# Altium schematic sheet L506_M_V1.1.SchDoc
size A3
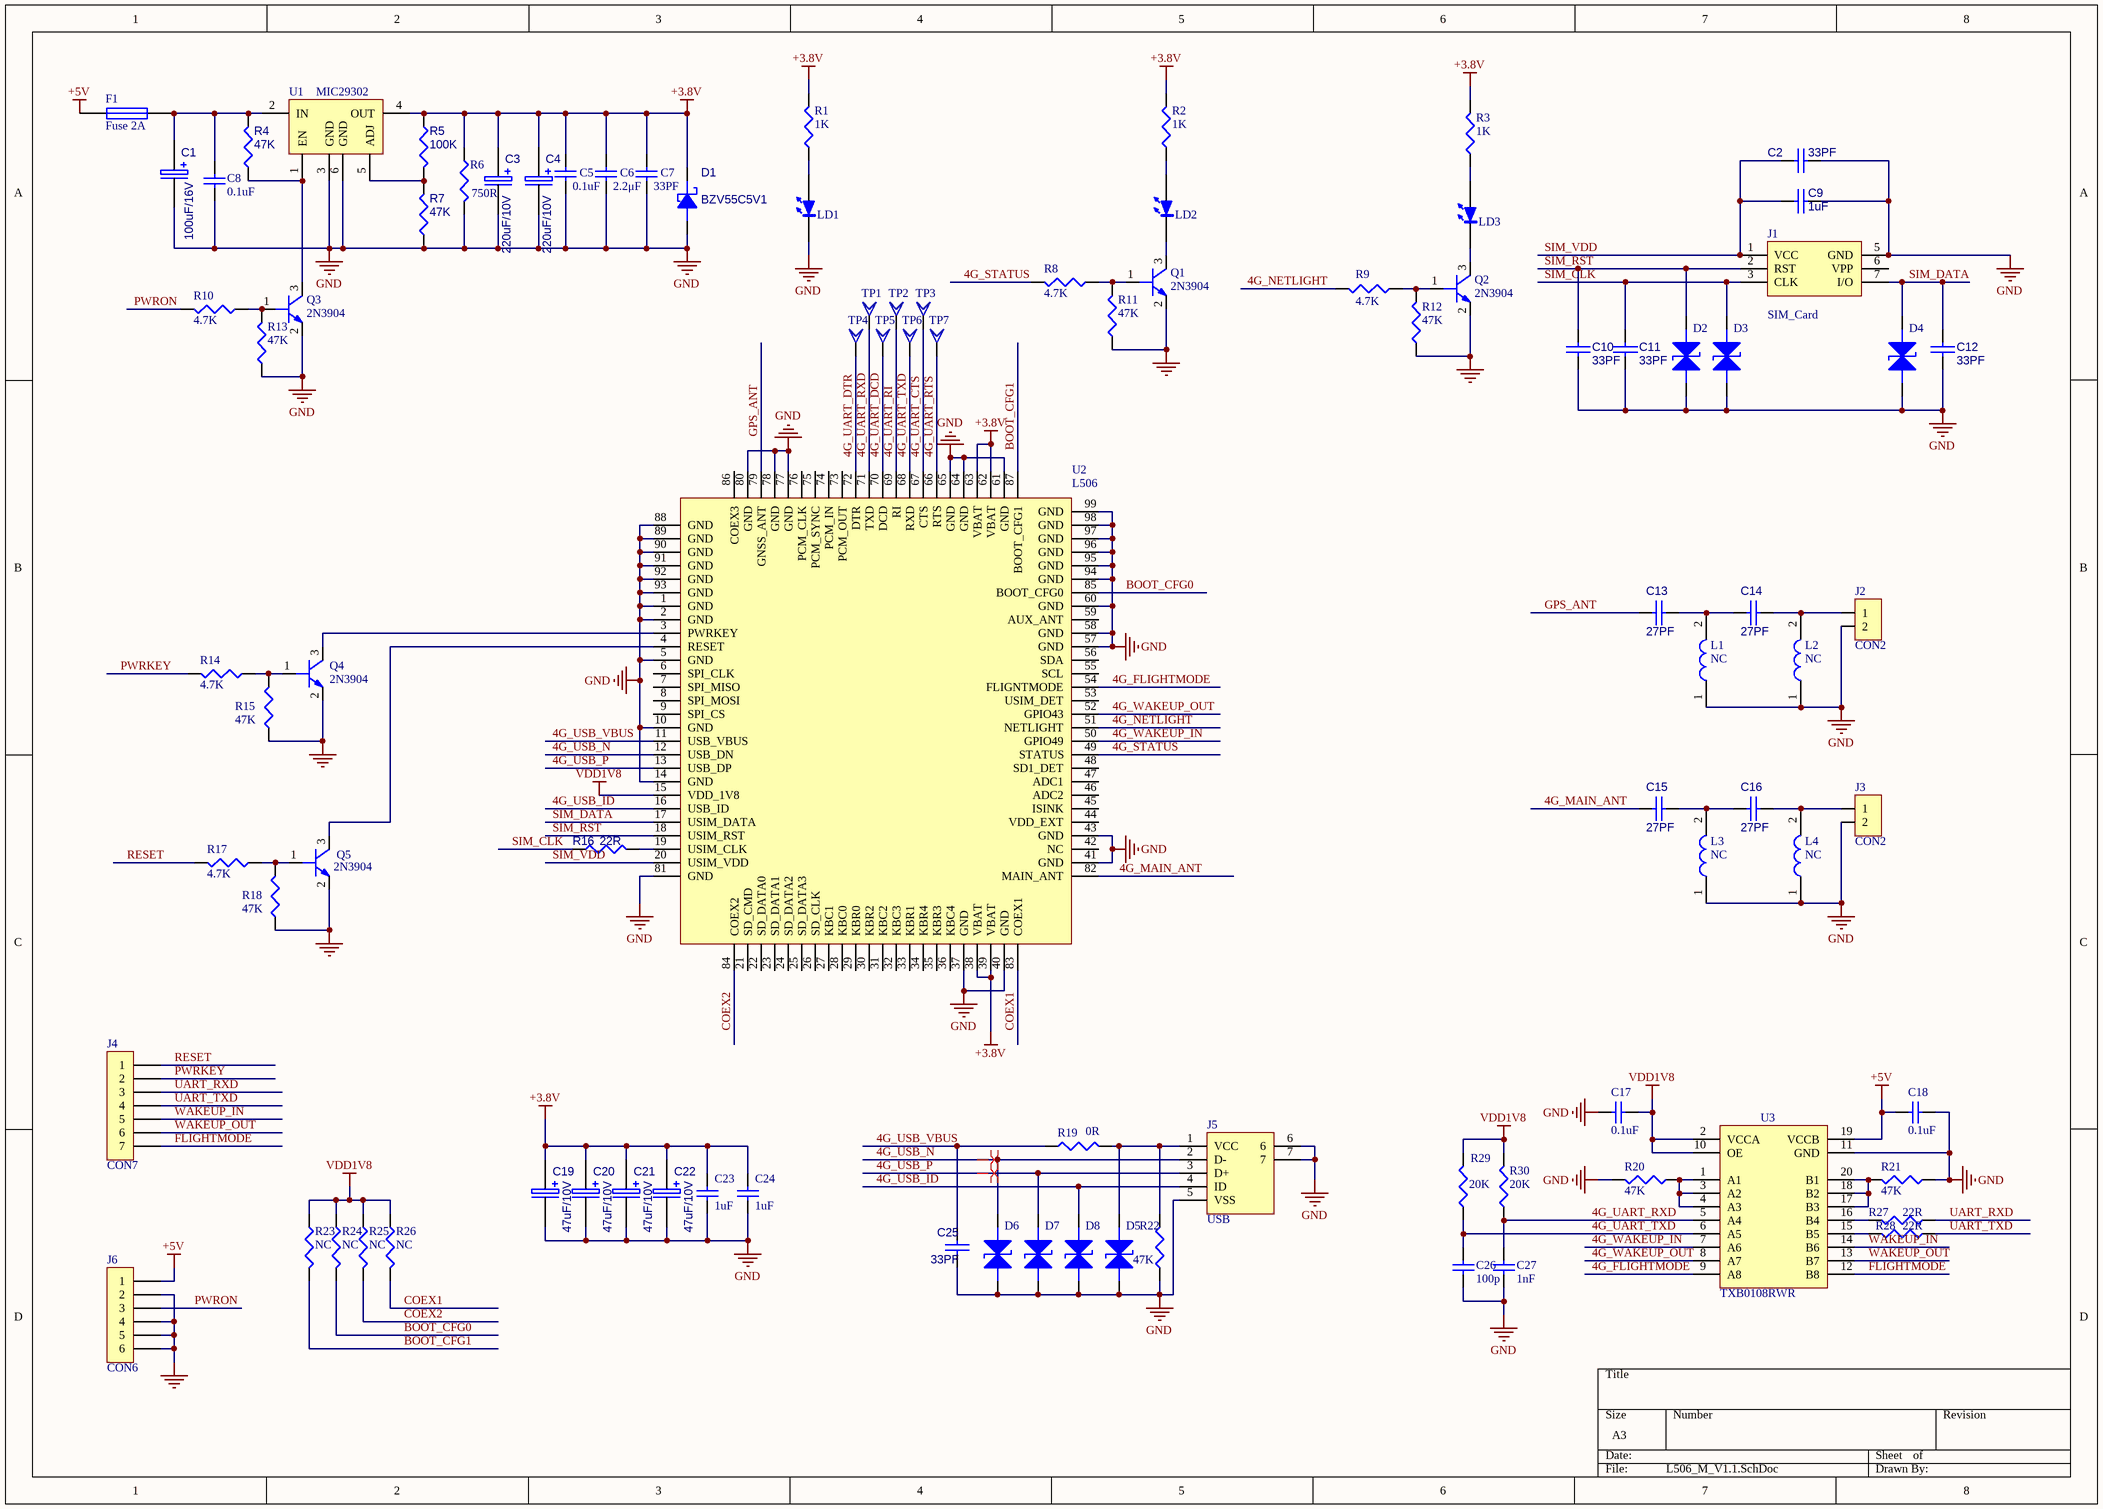
[diagram p0: L506_M_V1.1.SchDoc]

## Parts
C1  100uF/16V  [C_TAN_C]
C2  33PF  [0603_C]
C3  220uF/10V  [C_TAN_D]
C4  220uF/10V  [C_TAN_D]
C5  0.1uF  [0603_C]
C6  2.2μF  [0603_C]
C7  33PF  [0603_C]
C8  0.1uF  [0603_C]
C9  1uF  [0603_C]
C10  33PF  [0603_C]
C11  33PF  [0603_C]
C12  33PF  [0603_C]
C13  27PF  [0603_C]
C14  27PF  [0603_C]
C15  27PF  [0603_C]
C16  27PF  [0603_C]
C17  0.1uF  [0603_C]
C18  0.1uF  [0603_C]
C19  47uF/10V  [C_TAN_B]
C20  47uF/10V  [C_TAN_B]
C21  47uF/10V  [C_TAN_B]
C22  47uF/10V  [C_TAN_B]
C23  1uF  [0603_C]
C24  1uF  [0603_C]
C25  33PF  [0603_C]
C26  100p  [0603_C]
C27  1nF  [0603_C]
D1  BZV55C5V1  [SOD-80]
D2  EGA10603V05A1-B  [0603_R]  (value not drawn)
D3  EGA10603V05A1-B  [0603_R]  (value not drawn)
D4  EGA10603V05A1-B  [0603_R]  (value not drawn)
D5  EGA10603V05A1-B  [0603_R]  (value not drawn)
D6  EGA10603V05A1-B  [0603_R]  (value not drawn)
D7  EGA10603V05A1-B  [0603_R]  (value not drawn)
D8  EGA10603V05A1-B  [0603_R]  (value not drawn)
F1  Fuse 2A  [1812_F]
J1  SIM_Card  [MicroSIM-6]
J2  CON2  [RF-Z]
J3  CON2  [RF-Z]
J4  CON7  [SIP7]
J5  USB
J6  CON6  [SIP6]
L1  NC  [0603_R]
L2  NC  [0603_R]
L3  NC  [0603_R]
L4  NC  [0603_R]
LD1  WHITE  [LED_0603]  (value not drawn)
LD2  WHITE  [LED_0603]  (value not drawn)
LD3  WHITE  [LED_0603]  (value not drawn)
Q1  2N3904  [SOT23]
Q2  2N3904  [SOT23]
Q3  2N3904  [SOT23]
Q4  2N3904  [SOT23]
Q5  2N3904  [SOT23]
R1  1K  [0603_R]
R2  1K  [0603_R]
R3  1K  [0603_R]
R4  47K  [0603_R]
R5  100K  [0603_R]
R6  750R  [0603_R]
R7  47K  [0603_R]
R8  4.7K  [0603_R]
R9  4.7K  [0603_R]
R10  4.7K  [0603_R]
R11  47K  [0603_R]
R12  47K  [0603_R]
R13  47K  [0603_R]
R14  4.7K  [0603_R]
R15  47K  [0603_R]
R16  22R  [0603_R]
R17  4.7K  [0603_R]
R18  47K  [0603_R]
R19  0R  [0603_R]
R20  47K  [0603_R]
R21  47K  [0603_R]
R22  47K  [0603_R]
R23  NC  [0603_R]
R24  NC  [0603_R]
R25  NC  [0603_R]
R26  NC  [0603_R]
R27  22R  [0603_R]
R28  22R  [0603_R]
R29  20K  [0603_R]
R30  20K  [0603_R]
TP1  Component_1  [TP-40]  (value not drawn)
TP2  Component_1  [TP-40]  (value not drawn)
TP3  Component_1  [TP-40]  (value not drawn)
TP4  Component_1  [TP-40]  (value not drawn)
TP5  Component_1  [TP-40]  (value not drawn)
TP6  Component_1  [TP-40]  (value not drawn)
TP7  Component_1  [TP-40]  (value not drawn)
U1  MIC29302  [TO-263-5]
U2  L506  [L506]
U3  TXB0108RWR  [TSSP20]

## Nets
+3.8V: C3.1(+) C4.1(+) C5.2 C6.2 C7.2 C19.1(+) C20.1(+) C21.1(+) C22.1(+) C23.2 C24.2 D1.2(CATHODE) R1.1 R2.1 R3.1 R5.2 R6.2 U1.4(OUT) U2.38(VBAT) U2.39(VBAT) U2.62(VBAT) U2.63(VBAT)
+5V: C18.2 F1.1 J6.1 U3.19(VCCB)
GND: C1.2(-) C2.2 C3.2(-) C4.2(-) C5.1 C6.1 C7.1 C8.1 C9.2 C10.1 C11.1 C12.1 C17.1 C18.1 C19.2(-) C20.2(-) C21.2(-) C22.2(-) C23.1 C24.1 C25.1 C26.1 C27.1 D1.1(ANODE) D2.1 D3.1 D4.1 D5.1 D6.1 D7.1 D8.1 J1.5(GND) J2.2 J3.2 J5.5(VSS) J5.6 J5.7 J6.2 J6.4 J6.5 J6.6 L1.1 L2.1 L3.1 L4.1 LD1.K Q1.2(EMITTER) Q2.2(EMITTER) Q3.2(EMITTER) Q4.2(EMITTER) Q5.2(EMITTER) R6.1 R7.2 R11.2 R12.2 R13.2 R15.2 R18.2 R20.2 R21.1 R22.2 U1.3(GND) U1.6(GND) U2.1(GND) U2.2(GND) U2.5(GND) U2.10(GND) U2.14(GND) U2.37(GND) U2.40(GND) U2.41(GND) U2.43(GND) U2.57(GND) U2.58(GND) U2.60(GND) U2.61(GND) U2.64(GND) U2.65(GND) U2.77(GND) U2.78(GND) U2.80(GND) U2.81(GND) U2.88(GND) U2.89(GND) U2.90(GND) U2.91(GND) U2.92(GND) U2.93(GND) U2.94(GND) U2.95(GND) U2.96(GND) U2.97(GND) U2.98(GND) U2.99(GND) U3.11(GND)
VDD1V8: C17.2 R23.1 R24.1 R25.1 R26.1 R29.2 R30.2 U2.15(VDD_1V8) U3.2(VCCA) U3.10(OE)
4G_FLIGHTMODE: U2.54(FLIGNTMODE) U3.9(A8)
4G_MAIN_ANT: C15.1 U2.82(MAIN_ANT)
4G_NETLIGHT: R9.1 U2.51(NETLIGHT)
4G_STATUS: R8.1 U2.49(STATUS)
4G_UART_CTS: TP3.1 U2.67(CTS)
4G_UART_DCD: TP5.1 U2.70(DCD)
4G_UART_DTR: TP4.1 U2.72(DTR)
4G_UART_RI: TP2.1 U2.69(RI)
4G_UART_RTS: TP7.1 U2.66(RTS)
4G_UART_RXD: C27.2 R30.1 TP1.1 U2.71(TXD) U3.5(A4)
4G_UART_TXD: C26.2 R29.1 TP6.1 U2.68(RXD) U3.6(A5)
4G_USB_ID: D8.2 J5.4(ID) U2.16(USB_ID)
4G_USB_N: D6.2 J5.2(D-) U2.12(USB_DN)
4G_USB_P: D7.2 J5.3(D+) U2.13(USB_DP)
4G_USB_VBUS: C25.2 R19.1 U2.11(USB_VBUS)
4G_WAKEUP_IN: U2.50(GPIO49) U3.7(A6)
4G_WAKEUP_OUT: U2.52(GPIO43) U3.8(A7)
BOOT_CFG0: R24.2 U2.85(BOOT_CFG0)
BOOT_CFG1: R23.2 U2.87(BOOT_CFG1)
COEX1: R26.2 U2.83(COEX1)
COEX2: R25.2 U2.84(COEX2)
FLIGHTMODE: J4.7 U3.12(B8)
GPS_ANT: C13.1 U2.79(GNSS_ANT)
PWRKEY: J4.2 R14.1
PWRON: J6.3 R10.1
RESET: J4.1 R17.1
SIM_CLK: C11.2 D3.2 J1.3(CLK) R16.1
SIM_DATA: C12.2 D4.2 J1.7(I/O) U2.17(USIM_DATA)
SIM_RST: C10.2 D2.2 J1.2(RST) U2.18(USIM_RST)
SIM_VDD: C2.1 C9.1 J1.1(VCC) U2.20(USIM_VDD)
UART_RXD: J4.3 R27.1
UART_TXD: J4.4 R28.1
WAKEUP_IN: J4.5 U3.14(B6)
WAKEUP_OUT: J4.6 U3.13(B7)
NetC1_1: C1.1(+) C8.2 F1.2 R4.1 U1.2(IN)
NetC13_2: C13.2 C14.1 L1.2
NetC14_2: C14.2 J2.1 L2.2
NetC15_2: C15.2 C16.1 L3.2
NetC16_2: C16.2 J3.1 L4.2
NetD5_2: D5.2 J5.1(VCC) R19.2 R22.1
NetLD1_A: LD1.A R1.2
NetLD2_A: LD2.A R2.2
NetLD2_K: LD2.K Q1.3(COLLECTOR)
NetLD3_A: LD3.A R3.2
NetLD3_K: LD3.K Q2.3(COLLECTOR)
NetQ1_1: Q1.1(BASE) R8.2 R11.1
NetQ2_1: Q2.1(BASE) R9.2 R12.1
NetQ3_1: Q3.1(BASE) R10.2 R13.1
NetQ3_3: Q3.3(COLLECTOR) R4.2 U1.1(EN)
NetQ4_1: Q4.1(BASE) R14.2 R15.1
NetQ4_3: Q4.3(COLLECTOR) U2.3(PWRKEY)
NetQ5_1: Q5.1(BASE) R17.2 R18.1
NetQ5_3: Q5.3(COLLECTOR) U2.4(RESET)
NetR5_1: R5.1 R7.1 U1.5(ADJ)
NetR16_2: R16.2 U2.19(USIM_CLK)
NetR20_1: R20.1 U3.1(A1) U3.3(A2) U3.4(A3)
NetR21_2: R21.2 U3.17(B3) U3.18(B2) U3.20(B1)
NetR27_2: R27.2 U3.16(B4)
NetR28_2: R28.2 U3.15(B5)

Not connected (* = marked no-connect by the designer): J1 6(VPP); U2 6(SPI_CLK) 7(SPI_MISO) 8(SPI_MOSI) 9(SPI_CS) 21(SD_CMD) 22(SD_DATA0) 23(SD_DATA1) 24(SD_DATA2) 25(SD_DATA3) 26(SD_CLK) 27(KBC1) 28(KBC0) 29(KBR0) 30(KBR2) 31(KBC2) 32(KBC3) 33(KBR1) 34(KBR4) 35(KBR3) 36(KBC4) 42(NC) 44(VDD_EXT) 45(ISINK) 46(ADC2) 47(ADC1) 48(SD1_DET) 53(USIM_DET) 55(SCL) 56(SDA) 59(AUX_ANT) 73(PCM_OUT) 74(PCM_IN) 75(PCM_SYNC) 76(PCM_CLK) 86(COEX3)

## Layout directives
differential pair: 4G_USB_N, 4G_USB_P

## Library data of the parts
C1 C3 C4 C19-C22 = ECAP: E-CAP
C2 C9-C16 C25 = CAP
C5-C8 C17 C18 C23 C24 C26 C27 = Cap Semi: Capacitor; Published: 8-Jun-2000; LatestRevisionDate: 29-May-2009; LatestRevisionNote: IPC-7351 Footprint Added.; PackageReference: C1206; Publisher: Altium Limited; PackageDescription: Chip Capacitor
D1 = DIODE SCHOTTKY
D2-D8 = DIODE TVS BI-DIR
F1 = Fuse 1: Fuse; Published: 8-Jun-2000; LatestRevisionDate: 17-Jul-2002; LatestRevisionNote: Re-released for DXP Platform.; PackageReference: PIN-W2/E2.8; Publisher: Altium Limited; PackageDescription: Thru-Hole; 2 Leads
J5 = USB-M
L1-L4 = L
LD1-LD3 = LED
Q1-Q5 = NPN
R1-R3 R6 R8-R15 R17-R30 = RES1
R4 R5 R7 R16 = R0.25W: RESISTOR
U3 = TXB0108RGYR